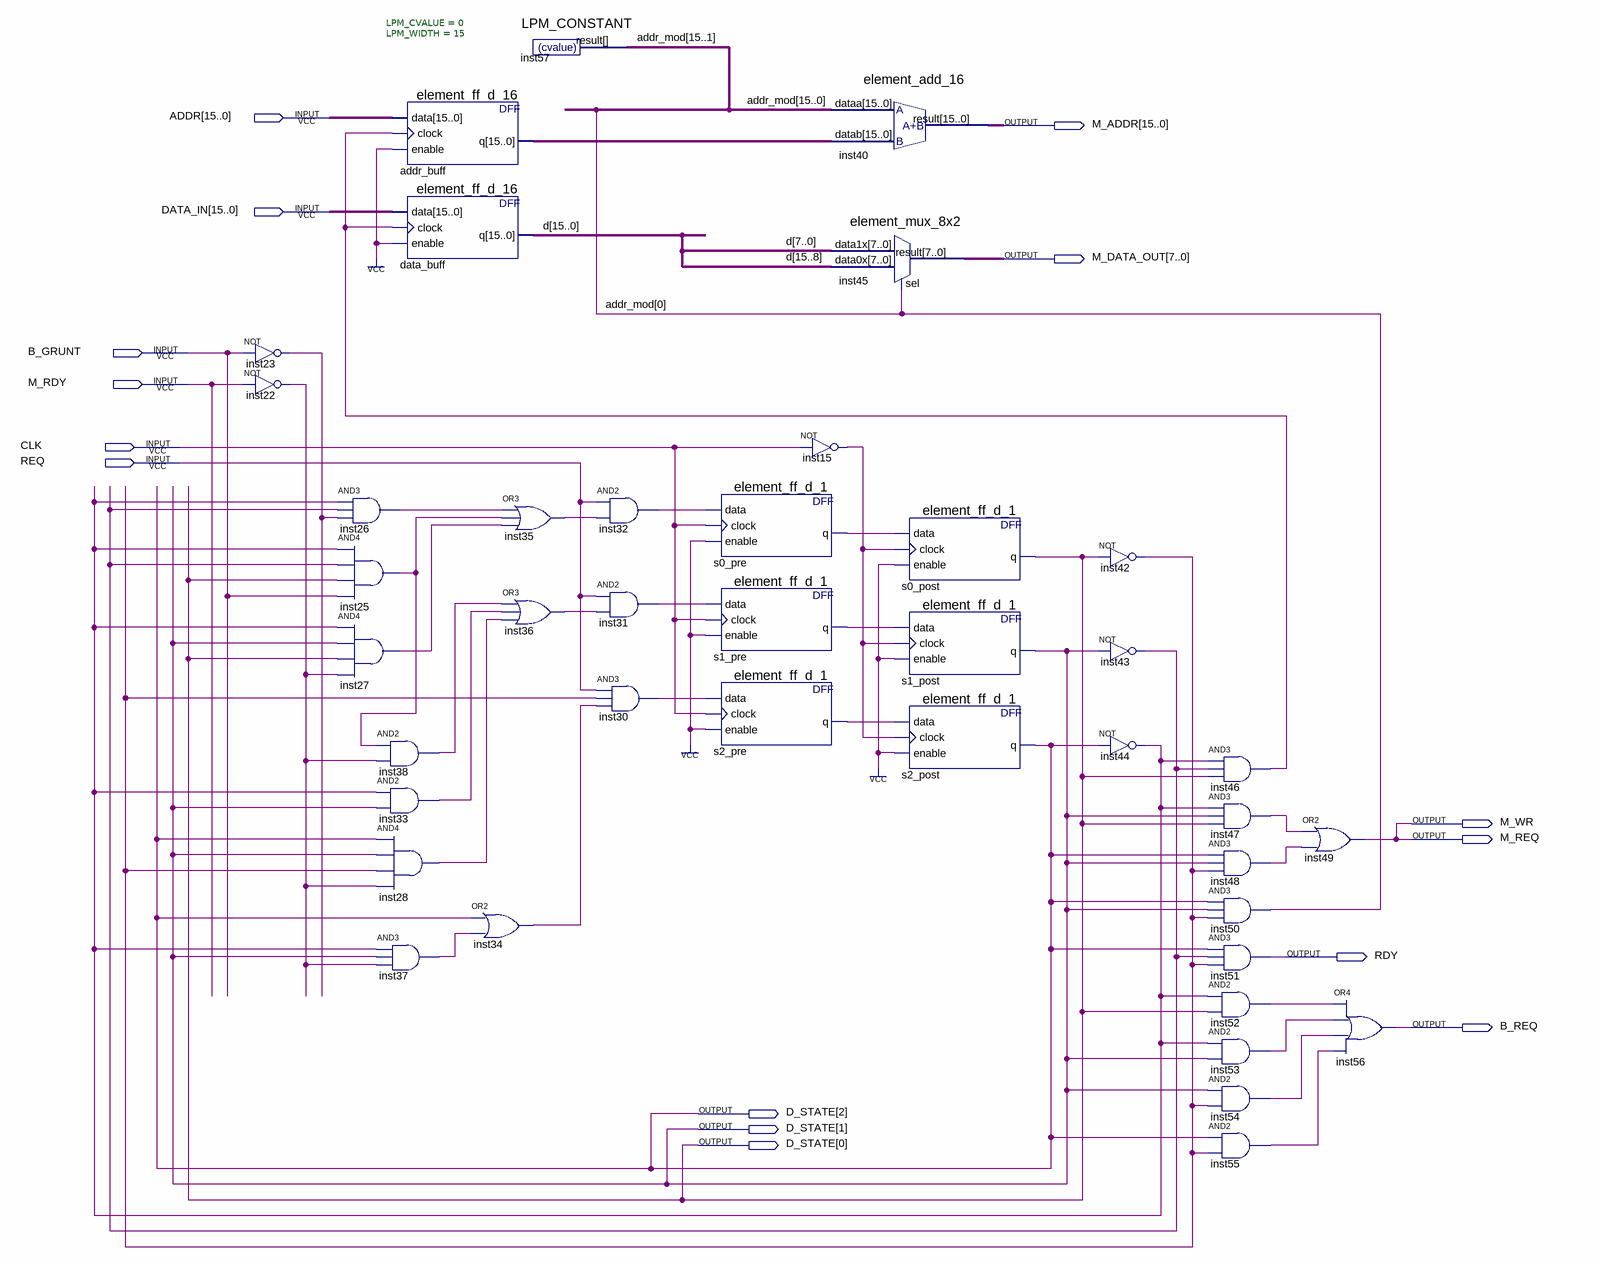
[diagram p0: schematic sheet]
// Quartus schematic block-data-cache-writer.bdf as structural Verilog: 41 symbols, 15 pins
module \block-data-cache-writer  (
  input  [15:0] ADDR,
  input  [15:0] DATA_IN,
  input  B_GRUNT,
  input  M_RDY,
  input  CLK,
  input  REQ,
  output [15:0] M_ADDR,
  output [7:0] M_DATA_OUT,
  output M_WR,
  output M_REQ,
  output RDY,
  output B_REQ,
  output [2:0] D_STATE
);

  wire inst15_out, inst22_out, inst23_out, inst25_out, inst26_out, inst27_out, inst28_out, inst30_out,
       inst31_out, inst32_out, inst33_out, inst34_out, inst35_out, inst36_out, inst37_out, inst38_out,
       inst42_out, inst43_out, inst44_out, inst46_out, inst47_out, inst48_out, inst52_out, inst53_out,
       inst54_out, inst55_out, s0_pre_q, s1_pre_q, s2_pre_q;
  wire [15:0] addr_buff_q, addr_mod, d;

  not inst23 (inst23_out, B_GRUNT);
  not inst22 (inst22_out, M_RDY);
  and inst26 (inst26_out, inst44_out, inst43_out, inst23_out);
  and inst25 (inst25_out, inst44_out, inst43_out, D_STATE[0], B_GRUNT);
  and inst27 (inst27_out, inst44_out, D_STATE[1], D_STATE[0], inst22_out);
  and inst38 (inst38_out, inst25_out, inst22_out);
  and inst33 (inst33_out, inst44_out, D_STATE[1]);
  and inst28 (inst28_out, D_STATE[2], D_STATE[1], inst42_out, inst22_out);
  and inst37 (inst37_out, inst44_out, D_STATE[1], inst22_out);
  element_ff_d_16 addr_buff (.data(ADDR), .clock(inst46_out), .enable(1'b1), .q(addr_buff_q));
  element_ff_d_16 data_buff (.data(DATA_IN), .clock(inst46_out), .enable(1'b1), .q(d));
  or inst35 (inst35_out, inst26_out, inst25_out, inst27_out);
  or inst36 (inst36_out, inst38_out, inst33_out, inst28_out);
  or inst34 (inst34_out, D_STATE[2], inst37_out);
  LPM_CONSTANT #(.LPM_CVALUE(0), .LPM_WIDTH(15)) inst57 (.result(addr_mod[15:1]));
  and inst32 (inst32_out, REQ, inst35_out);
  and inst31 (inst31_out, REQ, inst36_out);
  and inst30 (inst30_out, REQ, inst42_out, inst34_out);
  element_ff_d_1 s0_pre (.data(inst32_out), .clock(CLK), .enable(1'b1), .q(s0_pre_q));
  element_ff_d_1 s1_pre (.data(inst31_out), .clock(CLK), .enable(1'b1), .q(s1_pre_q));
  element_ff_d_1 s2_pre (.data(inst30_out), .clock(CLK), .enable(1'b1), .q(s2_pre_q));
  not inst15 (inst15_out, CLK);
  element_add_16 inst40 (.dataa(addr_mod), .datab(addr_buff_q), .result(M_ADDR));
  element_mux_8x2 inst45 (.data1x(d[7:0]), .data0x(d[15:8]), .sel(addr_mod[0]), .result(M_DATA_OUT));
  element_ff_d_1 s0_post (.data(s0_pre_q), .clock(inst15_out), .enable(1'b1), .q(D_STATE[0]));
  element_ff_d_1 s1_post (.data(s1_pre_q), .clock(inst15_out), .enable(1'b1), .q(D_STATE[1]));
  element_ff_d_1 s2_post (.data(s2_pre_q), .clock(inst15_out), .enable(1'b1), .q(D_STATE[2]));
  not inst42 (inst42_out, D_STATE[0]);
  not inst43 (inst43_out, D_STATE[1]);
  not inst44 (inst44_out, D_STATE[2]);
  and inst46 (inst46_out, inst44_out, inst43_out, D_STATE[0]);
  and inst47 (inst47_out, inst44_out, D_STATE[1], D_STATE[0]);
  and inst48 (inst48_out, D_STATE[2], D_STATE[1], inst42_out);
  and inst50 (addr_mod[0], D_STATE[2], D_STATE[1], inst42_out);
  and inst51 (RDY, D_STATE[2], inst43_out, inst42_out);
  and inst52 (inst52_out, inst44_out, D_STATE[0]);
  and inst53 (inst53_out, inst44_out, D_STATE[1]);
  and inst54 (inst54_out, D_STATE[1], inst42_out);
  and inst55 (inst55_out, D_STATE[2], inst42_out);
  or inst49 (M_REQ, inst47_out, inst48_out);
  or inst56 (B_REQ, inst52_out, inst53_out, inst54_out, inst55_out);

  assign M_WR = M_REQ;
endmodule
